# Altium schematic sheet Clock.SchDoc
size A4
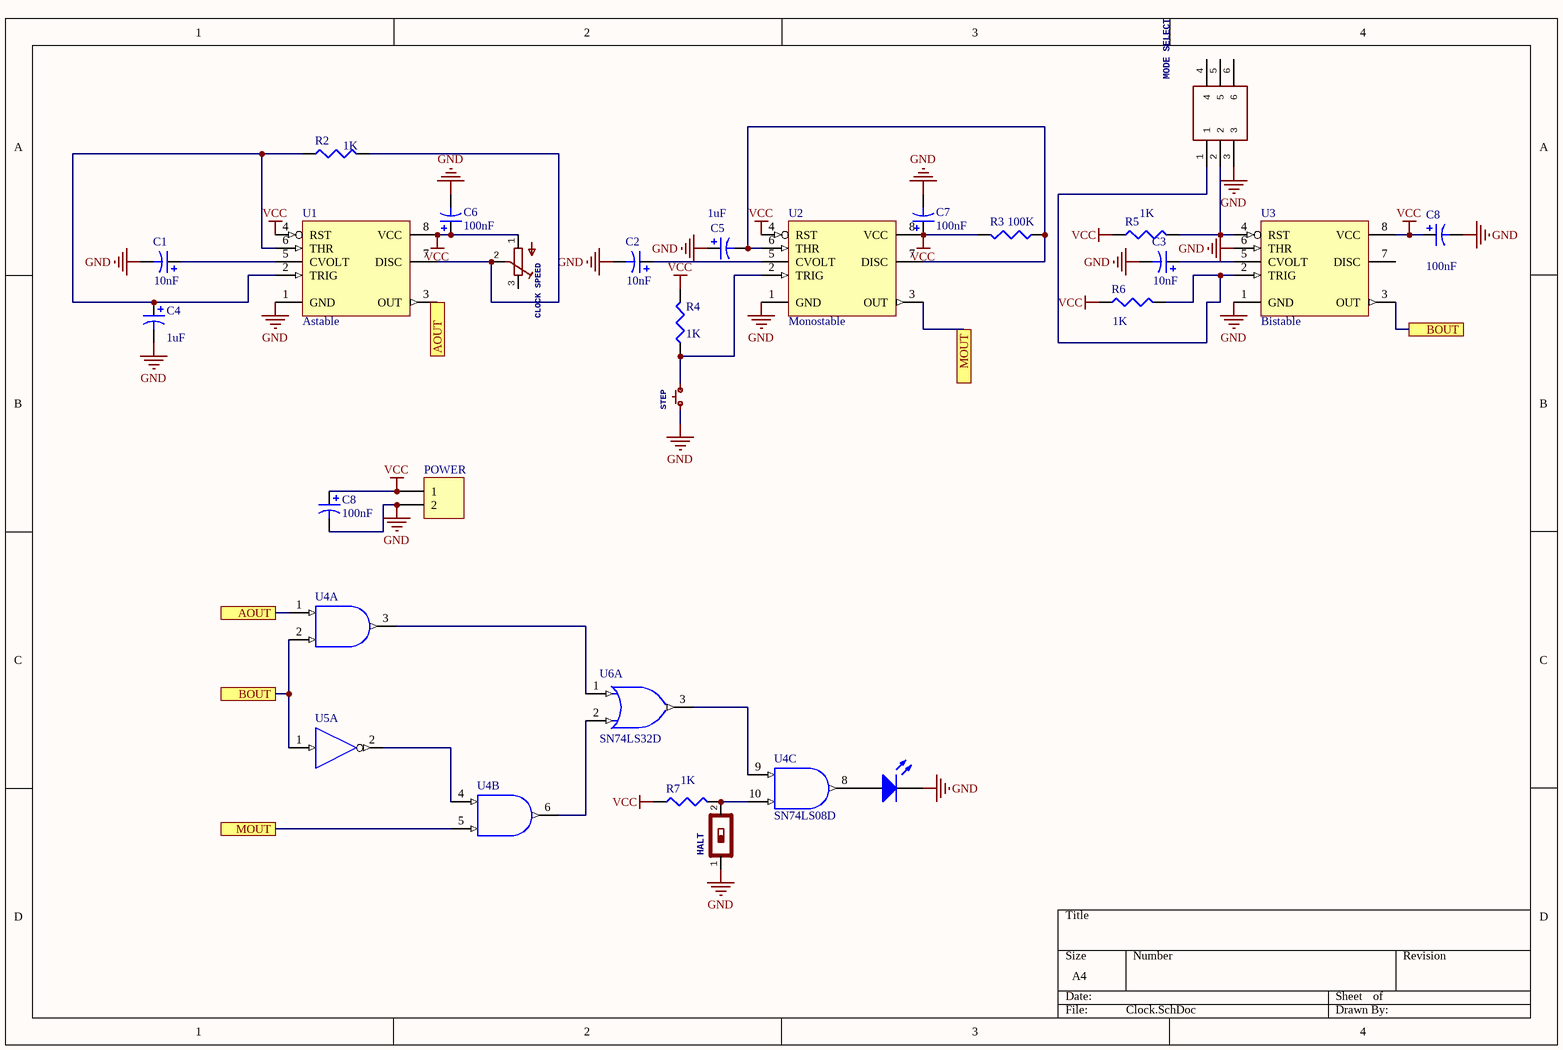
[diagram p0: Clock.SchDoc]

## Parts
(Parts that share a designator on the sheet are numbered #1, #2 ... from top to bottom, then left to right.)
C1  value 10nF  [C0805]  (hidden comment: Cap Pol3)
C2  value 10nF  [C0805]  (hidden comment: Cap Pol3)
C3  value 10nF  [C0805]  (hidden comment: Cap Pol3)
C4  value 1uF  [RAD-0.1]  (hidden comment: Cap Pol1)
C5  value 1uF  [RAD-0.1]  (hidden comment: Cap Pol1)
C6  value 100nF  [C0805]  (hidden comment: Cap Pol3)
C7  value 100nF  [C0805]  (hidden comment: Cap Pol3)
C8#1  value 100nF  [C0805]  (hidden comment: Cap Pol3)
C8#2  value 100nF  [C0805]  (hidden comment: Cap Pol3)
CLOCK_SPEED  3386 Series3/8" Square Trimmer  [3386F]  (value not drawn)
D1  Clock  [14-1210]  (value not drawn)
HALT  SMD Dip Switch 1 pol.  [SOP127P1030X250-2N]  (value not drawn)
MODE_SELECT  Pushbutton Switches DPDT Latching ON-ONSource:  Datasheet  [GPBS800L]  (value not drawn)
POWER  Header 2  [HDR1X2]  (value not drawn)
R2  value 1K  [J1-0603]  (hidden comment: Res3)
R3  value 100K  [J1-0603]  (hidden comment: Res3)
R4  value 1K  [J1-0603]  (hidden comment: Res4)
R5  value 1K  [J1-0603]  (hidden comment: Res3)
R6  value 1K  [J1-0603]  (hidden comment: Res3)
R7  value 1K  [J1-0603]  (hidden comment: Res3)
STEP  SPST.B3U-1000P(M)  [B3U-1000P(M)]  (value not drawn)
U1  Astable  [D008_N]
U2  Monostable  [D008_N]
U3  Bistable  [D008_N]
U4  SN74LS08D  [D014_N]  (value not drawn)  (parts A,B,C of 4)
U5  SN74LS04D  [D014_N]  (value not drawn)  (part A of 6)
U6  SN74LS32D  [D014_N]  (part A of 4)

## Ports
AOUT, BOUT, MOUT

## Nets
GND: C1.2 C2.2 C3.2 C4.2 C5.1 C6.2 C7.2 C8#1.2 C8#2.2 D1.2(K) HALT.1 MODE_SELECT.3 POWER.2 STEP.1 U1.1(GND) U2.1(GND) U3.1(GND) U3.6(THR) U4.7(GND) U5.7(GND) U6.7(GND)
VCC: C6.1 C7.1 C8#1.1 C8#2.1 CLOCK_SPEED.1 POWER.1 R3.2 R4.2 R5.1 R6.1 R7.1 U1.4(RST) U1.8(VCC) U2.4(RST) U2.8(VCC) U3.8(VCC) U4.14(VCC) U5.14(VCC) U6.14(VCC)
AOUT: U1.3(OUT) U4.1(A) ; port AOUT
BOUT: U3.3(OUT) U4.2(B) U5.1(A) ; port BOUT
MOUT: U2.3(OUT) U4.5(B) ; port MOUT
NetC1_1: C1.1 U1.5(CVOLT)
NetC2_1: C2.1 U2.5(CVOLT)
NetC3_1: C3.1 U3.5(CVOLT)
NetC4_1: C4.1 R2.1 U1.2(TRIG) U1.6(THR)
NetC5_2: C5.2 R3.1 U2.6(THR) U2.7(DISC)
NetCLOCK_SPEED_2: CLOCK_SPEED.2 R2.2 U1.7(DISC)
NetD1_1: D1.1(A) U4.8(Y)
NetHALT_2: HALT.2 R7.2 U4.10(B)
NetMODE_SELECT_1: MODE_SELECT.1 R6.2 U3.2(TRIG)
NetMODE_SELECT_2: MODE_SELECT.2 R5.2 U3.4(RST)
NetR4_1: R4.1 STEP.2 U2.2(TRIG)
NetU4_3: U4.3(Y) U6.1(A)
NetU4_4: U4.4(A) U5.2(Y)
NetU4_6: U4.6(Y) U6.2(B)
NetU4_9: U4.9(A) U6.3(Y)

Not connected (* = marked no-connect by the designer): CLOCK_SPEED 3; MODE_SELECT 4 5 6; U3 7(DISC)

## Library data of the parts
C1-C3 C6 C7 C8#1 C8#2 = Cap Pol3: Polarized Capacitor (Surface Mount); Published: 8-Jun-2000; LatestRevisionDate: 29-May-2009; LatestRevisionNote: IPC-7351 Footprint Added.; PackageReference: C0805; Publisher: Altium Limited; PackageDescription: Chip Capacitor
C4 C5 = Cap Pol1: Polarized Capacitor (Radial); Published: 8-Jun-2000; LatestRevisionDate: 17-Jul-2002; LatestRevisionNote: Re-released for DXP Platform.; PackageReference: RB7.6-15; Publisher: Altium Limited; PackageDescription: Polarized Capacitor (Radial); 2 Leads
CLOCK_SPEED = 3386-F: GateName_1: G$1; SymbolName_1: TPOT; DeviceName: F; DeviceSetName: 3386-; LibraryName: bourns_good; Package: 3386F
D1 = LED0: Typical INFRARED GaAs LED; Published: 8-Jun-2000; LatestRevisionDate: 08-Jul-2005; LatestRevisionNote: Mech Layer 1 removed.; PackageReference: LED-0; Publisher: Altium Limited; PackageDescription: LED; 2 Leads
HALT = SWS001: GateName_1: G$1; SymbolName_1: DIP01; LibraryName: smd-special; DeviceSetName: SWS001; Package: SMS-001
MODE_SELECT = GPBS-800L: MANUFACTURER_NAME: CW Industries; GateName_1: G$1; SymbolName_1: GPBS-800L; LibraryName: GPBS-800L; DeviceSetName: GPBS-800L; Package: GPBS800L; ARROW_PART_NUMBER: GPBS-800L; HEIGHT: 13mm; MANUFACTURER_PART_NUMBER: GPBS-800L
POWER = Header 2: Header, 2-Pin; LatestRevisionDate: 17-Jul-2002; LatestRevisionNote: Re-released for DXP Platform.; Publisher: Altium Limited
R2-R7 = Res3: Resistor; Published: 8-Jun-2000; LatestRevisionDate: 29-May-2009; LatestRevisionNote: IPC-7351 Footprint Added.; PackageReference: J1-0603; Publisher: Altium Limited; PackageDescription: Chip Resistor
STEP = SPST.B3U-1000P(M): GateName_1: G$1; SymbolName_1: SPST; DeviceName: .B3U-1000P(M); LibraryName: smd_switches; DeviceSetName: SPST; Package: B3U-1000P(M)
U1-U3 = NE555D: Precision Timer; Published: 16-Jan-2001; LatestRevisionDate: 13-Apr-2006; LatestRevisionNote: IPC-7351 Footprint Added.; DatasheetVersion: Feb-1992; PackageVersion: Jan-1998; PackageReference: D008; Publisher: Altium Limited; PackageDescription: 8-Pin Small Outline Integrated Circuit 1.27 mm Pitch; Code_IPC: SOIC127P600-8; ComponentLink1Description: Manufacturer Link; ComponentLink1URL: http://www.ti.com/; ComponentLink2Description: Datasheet; ComponentLink2URL: http://www-s.ti.com/sc/ds/ne555.pdf
U4 = SN74LS08D: Quadruple 2-Input Positive-AND Gate; Published: 8-Jun-2000; LatestRevisionDate: 13-Apr-2006; LatestRevisionNote: IPC-7351 Footprint Added.; DatasheetVersion: Mar-1988; PackageVersion: Jan-1998; PackageReference: D014; Publisher: Altium Limited; PackageDescription: 14-Pin Small Outline Integrated Circuit 1.27 mm Pitch; Code_IPC: SOIC127P600-14; ComponentLink1Description: Manufacturer Link; ComponentLink1URL: http://www.ti.com/; ComponentLink2Description: Datasheet; ComponentLink2URL: http://www-s.ti.com/sc/ds/SN74LS08.pdf
U5 = SN74LS04D: Hex Inverter; Published: 8-Jun-2000; LatestRevisionDate: 13-Apr-2006; LatestRevisionNote: IPC-7351 Footprint Added.; DatasheetVersion: Mar-1988; PackageVersion: Jan-1998; PackageReference: D014; Publisher: Altium Limited; PackageDescription: 14-Pin Small Outline Integrated Circuit 1.27 mm Pitch; Code_IPC: SOIC127P600-14; ComponentLink1Description: Manufacturer Link; ComponentLink1URL: http://www.ti.com/; ComponentLink2Description: Datasheet; ComponentLink2URL: http://www-s.ti.com/sc/ds/sn74ls04.pdf
U6 = SN74LS32D: Quadruple 2-Input Positive-OR Gate; Published: 8-Jun-2000; LatestRevisionDate: 13-Apr-2006; LatestRevisionNote: IPC-7351 Footprint Added.; DatasheetVersion: Mar-1988; PackageVersion: Jan-1998; PackageReference: D014; Publisher: Altium Limited; PackageDescription: 14-Pin Small Outline Integrated Circuit 1.27 mm Pitch; Code_IPC: SOIC127P600-14; ComponentLink1Description: Manufacturer Link; ComponentLink1URL: http://www.ti.com/; ComponentLink2Description: Datasheet; ComponentLink2URL: http://www-s.ti.com/sc/ds/sn74ls32.pdf